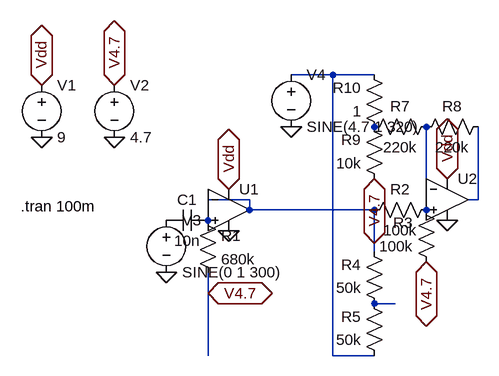
[diagram p0: schematic mixersTest.asc]
mixersTest.asc, the LTspice schematic file:
Version 4
SHEET 1 880 680
WIRE 224 -112 160 -112
WIRE 288 -112 224 -112
WIRE 368 64 368 -32
WIRE 96 80 32 80
WIRE 448 80 448 -32
WIRE 448 80 432 80
WIRE 96 96 96 80
WIRE 288 96 96 96
WIRE 288 160 288 96
WIRE 32 224 32 192
WIRE 320 240 288 240
WIRE 32 320 32 224
WIRE 224 320 224 -112
WIRE 288 320 224 320
FLAG 64 128 0
FLAG 400 112 0
FLAG -224 -16 0
FLAG -112 -16 0
FLAG -224 -96 Vdd
IOPIN -224 -96 BiDir
FLAG 64 64 Vdd
IOPIN 64 64 BiDir
FLAG 400 48 Vdd
IOPIN 400 48 BiDir
FLAG -112 -96 V4.7
IOPIN -112 -96 BiDir
FLAG 32 224 V4.7
IOPIN 32 224 BiDir
FLAG 368 176 V4.7
IOPIN 368 176 BiDir
FLAG 288 48 V4.7
IOPIN 288 48 BiDir
FLAG 160 -32 0
FLAG -32 192 0
SYMBOL Opamps\\UniversalOpamp2 64 96 R0
SYMATTR InstName U1
SYMBOL Opamps\\UniversalOpamp2 400 80 R0
SYMATTR InstName U2
SYMBOL voltage -224 -112 R0
WINDOW 123 0 0 Left 0
WINDOW 39 0 0 Left 0
SYMATTR InstName V1
SYMATTR Value 9
SYMBOL voltage -112 -112 R0
WINDOW 123 0 0 Left 0
WINDOW 39 0 0 Left 0
SYMATTR InstName V2
SYMATTR Value 4.7
SYMBOL cap 32 96 R90
WINDOW 0 0 32 VBottom 2
WINDOW 3 32 32 VTop 2
SYMATTR InstName C1
SYMATTR Value 10n
SYMBOL res 16 96 R0
SYMATTR InstName R1
SYMATTR Value 680k
SYMBOL res 384 80 R90
WINDOW 0 0 56 VBottom 2
WINDOW 3 32 56 VTop 2
SYMATTR InstName R2
SYMATTR Value 100k
SYMBOL res 384 192 R180
WINDOW 0 36 76 Left 2
WINDOW 3 36 40 Left 2
SYMATTR InstName R3
SYMATTR Value 100k
SYMBOL res 304 256 R180
WINDOW 0 36 76 Left 2
WINDOW 3 36 40 Left 2
SYMATTR InstName R4
SYMATTR Value 50k
SYMBOL res 304 336 R180
WINDOW 0 36 76 Left 2
WINDOW 3 36 40 Left 2
SYMATTR InstName R5
SYMATTR Value 50k
SYMBOL res 384 -48 R90
WINDOW 0 0 56 VBottom 2
WINDOW 3 32 56 VTop 2
SYMATTR InstName R7
SYMATTR Value 220k
SYMBOL res 464 -48 R90
WINDOW 0 0 56 VBottom 2
WINDOW 3 32 56 VTop 2
SYMATTR InstName R8
SYMATTR Value 220k
SYMBOL res 304 64 R180
WINDOW 0 36 76 Left 2
WINDOW 3 36 40 Left 2
SYMATTR InstName R9
SYMATTR Value 10k
SYMBOL res 304 -16 R180
WINDOW 0 36 76 Left 2
WINDOW 3 36 40 Left 2
SYMATTR InstName R10
SYMATTR Value 1
SYMBOL voltage -32 96 R0
WINDOW 123 0 0 Left 0
WINDOW 39 0 0 Left 0
SYMATTR InstName V3
SYMATTR Value SINE(0 1 300)
SYMBOL voltage 160 -128 R0
WINDOW 123 0 0 Left 0
WINDOW 39 0 0 Left 0
SYMATTR InstName V4
SYMATTR Value SINE(4.7 1 320)
TEXT -256 90 Left 2 !.tran 100m

The netlist it stands for:
* mixersTest.asc
XU1 P001 N003 Vdd 0 N003 level.2 Avol=1Meg GBW=10Meg Slew=10Meg ilimit=25m rail=0 Vos=0 phimargin=45 en=0 enk=0 in=0 ink=0 Rin=500Meg  ; pins IN+ IN- V+ V- OUT
XU2 P002 N002 Vdd 0 N004 level.2 Avol=1Meg GBW=10Meg Slew=10Meg ilimit=25m rail=0 Vos=0 phimargin=45 en=0 enk=0 in=0 ink=0 Rin=500Meg  ; pins IN+ IN- V+ V- OUT
V1 Vdd 0 9
V2 V4.7 0 4.7
C1 P001 P003 10n
R1 P001 V4.7 680k
R2 P002 N003 100k
R3 V4.7 P002 100k
R4 N005 N003 50k
R5 N001 N005 50k
R7 N002 P004 220k
R8 N004 N002 220k
R9 V4.7 P004 10k
R10 P004 N001 1
V3 P003 0 SINE(0 1 300)
V4 N001 0 SINE(4.7 1 320)
.tran 100m
.lib UniversalOpamps2.sub
.backanno
.end